# Altium schematic sheet MIDDLE LAYER.SchDoc
size A
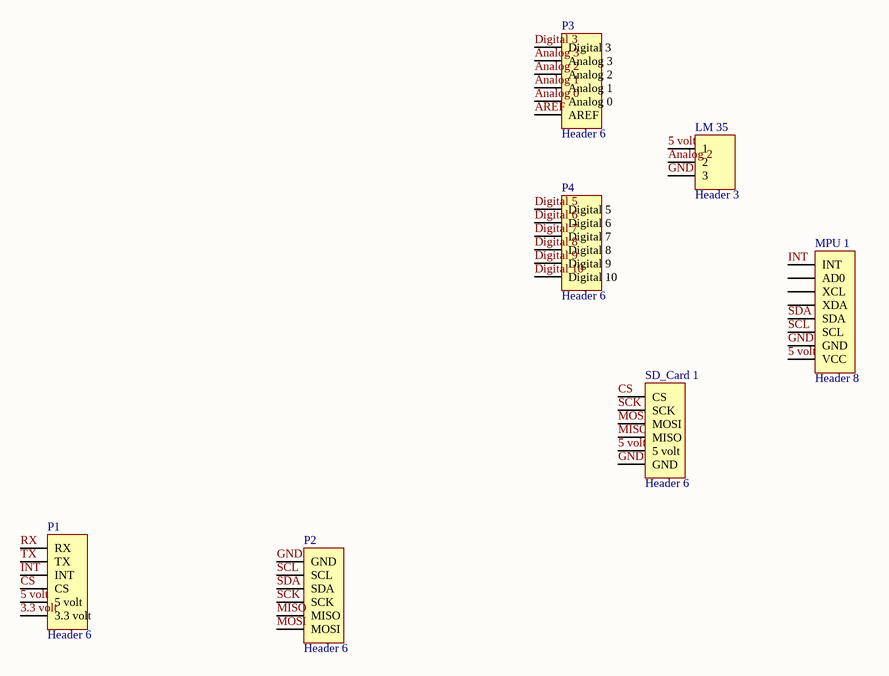
[diagram p0: MIDDLE LAYER.SchDoc]

## Parts
LM_35  Header 3  [HDR1X3]
MPU_1  Header 8  [HDR1X8]
P1  Header 6  [HDR1X6]
P2  Header 6  [HDR1X6]
P3  Header 6  [HDR1X6]
P4  Header 6  [HDR1X6]
SD_Card_1  Header 6  [HDR1X6]

## Nets
3.3 volt: P1.6(3.3_volt)
5 volt: LM_35.1 MPU_1.8(VCC) P1.5(5_volt) SD_Card_1.5(5_volt)
Analog 0: P3.5(Analog_0)
Analog 1: P3.4(Analog_1)
Analog 2: LM_35.2 P3.3(Analog_2)
Analog 3: P3.2(Analog_3)
AREF: P3.6(AREF)
CS: P1.4(CS) SD_Card_1.1(CS)
Digital 3: P3.1(Digital_3)
Digital 5: P4.1(Digital_5)
Digital 6: P4.2(Digital_6)
Digital 7: P4.3(Digital_7)
Digital 8: P4.4(Digital_8)
Digital 9: P4.5(Digital_9)
Digital 10: P4.6(Digital_10)
GND: LM_35.3 MPU_1.7(GND) P2.1(GND) SD_Card_1.6(GND)
INT: MPU_1.1(INT) P1.3(INT)
MISO: P2.5(MISO) SD_Card_1.4(MISO)
MOSI: P2.6(MOSI) SD_Card_1.3(MOSI)
RX: P1.1(RX)
SCK: P2.4(SCK) SD_Card_1.2(SCK)
SCL: MPU_1.6(SCL) P2.2(SCL)
SDA: MPU_1.5(SDA) P2.3(SDA)
TX: P1.2(TX)

Not connected (* = marked no-connect by the designer): MPU_1 2(AD0) 3(XCL) 4(XDA)

## Library data of the parts
LM_35 = Header 3: Header, 3-Pin; LatestRevisionDate: 17-Jul-2002; LatestRevisionNote: Re-released for DXP Platform.; Publisher: Altium Limited
MPU_1 = Header 8: Header, 8-Pin; LatestRevisionDate: 17-Jul-2002; LatestRevisionNote: Re-released for DXP Platform.; Publisher: Altium Limited
P1-P4 SD_Card_1 = Header 6: Header, 6-Pin; LatestRevisionDate: 17-Jul-2002; LatestRevisionNote: Re-released for DXP Platform.; Publisher: Altium Limited